# EasyEDA schematic SCH_Fisurometro_v2_2025-02-20.json
TITLE: Fisurómetro; REV: 1.0; Date: 2025-02-19; Sheet: 1/1; Drawn By: miguelenterria; Company: MediaLab
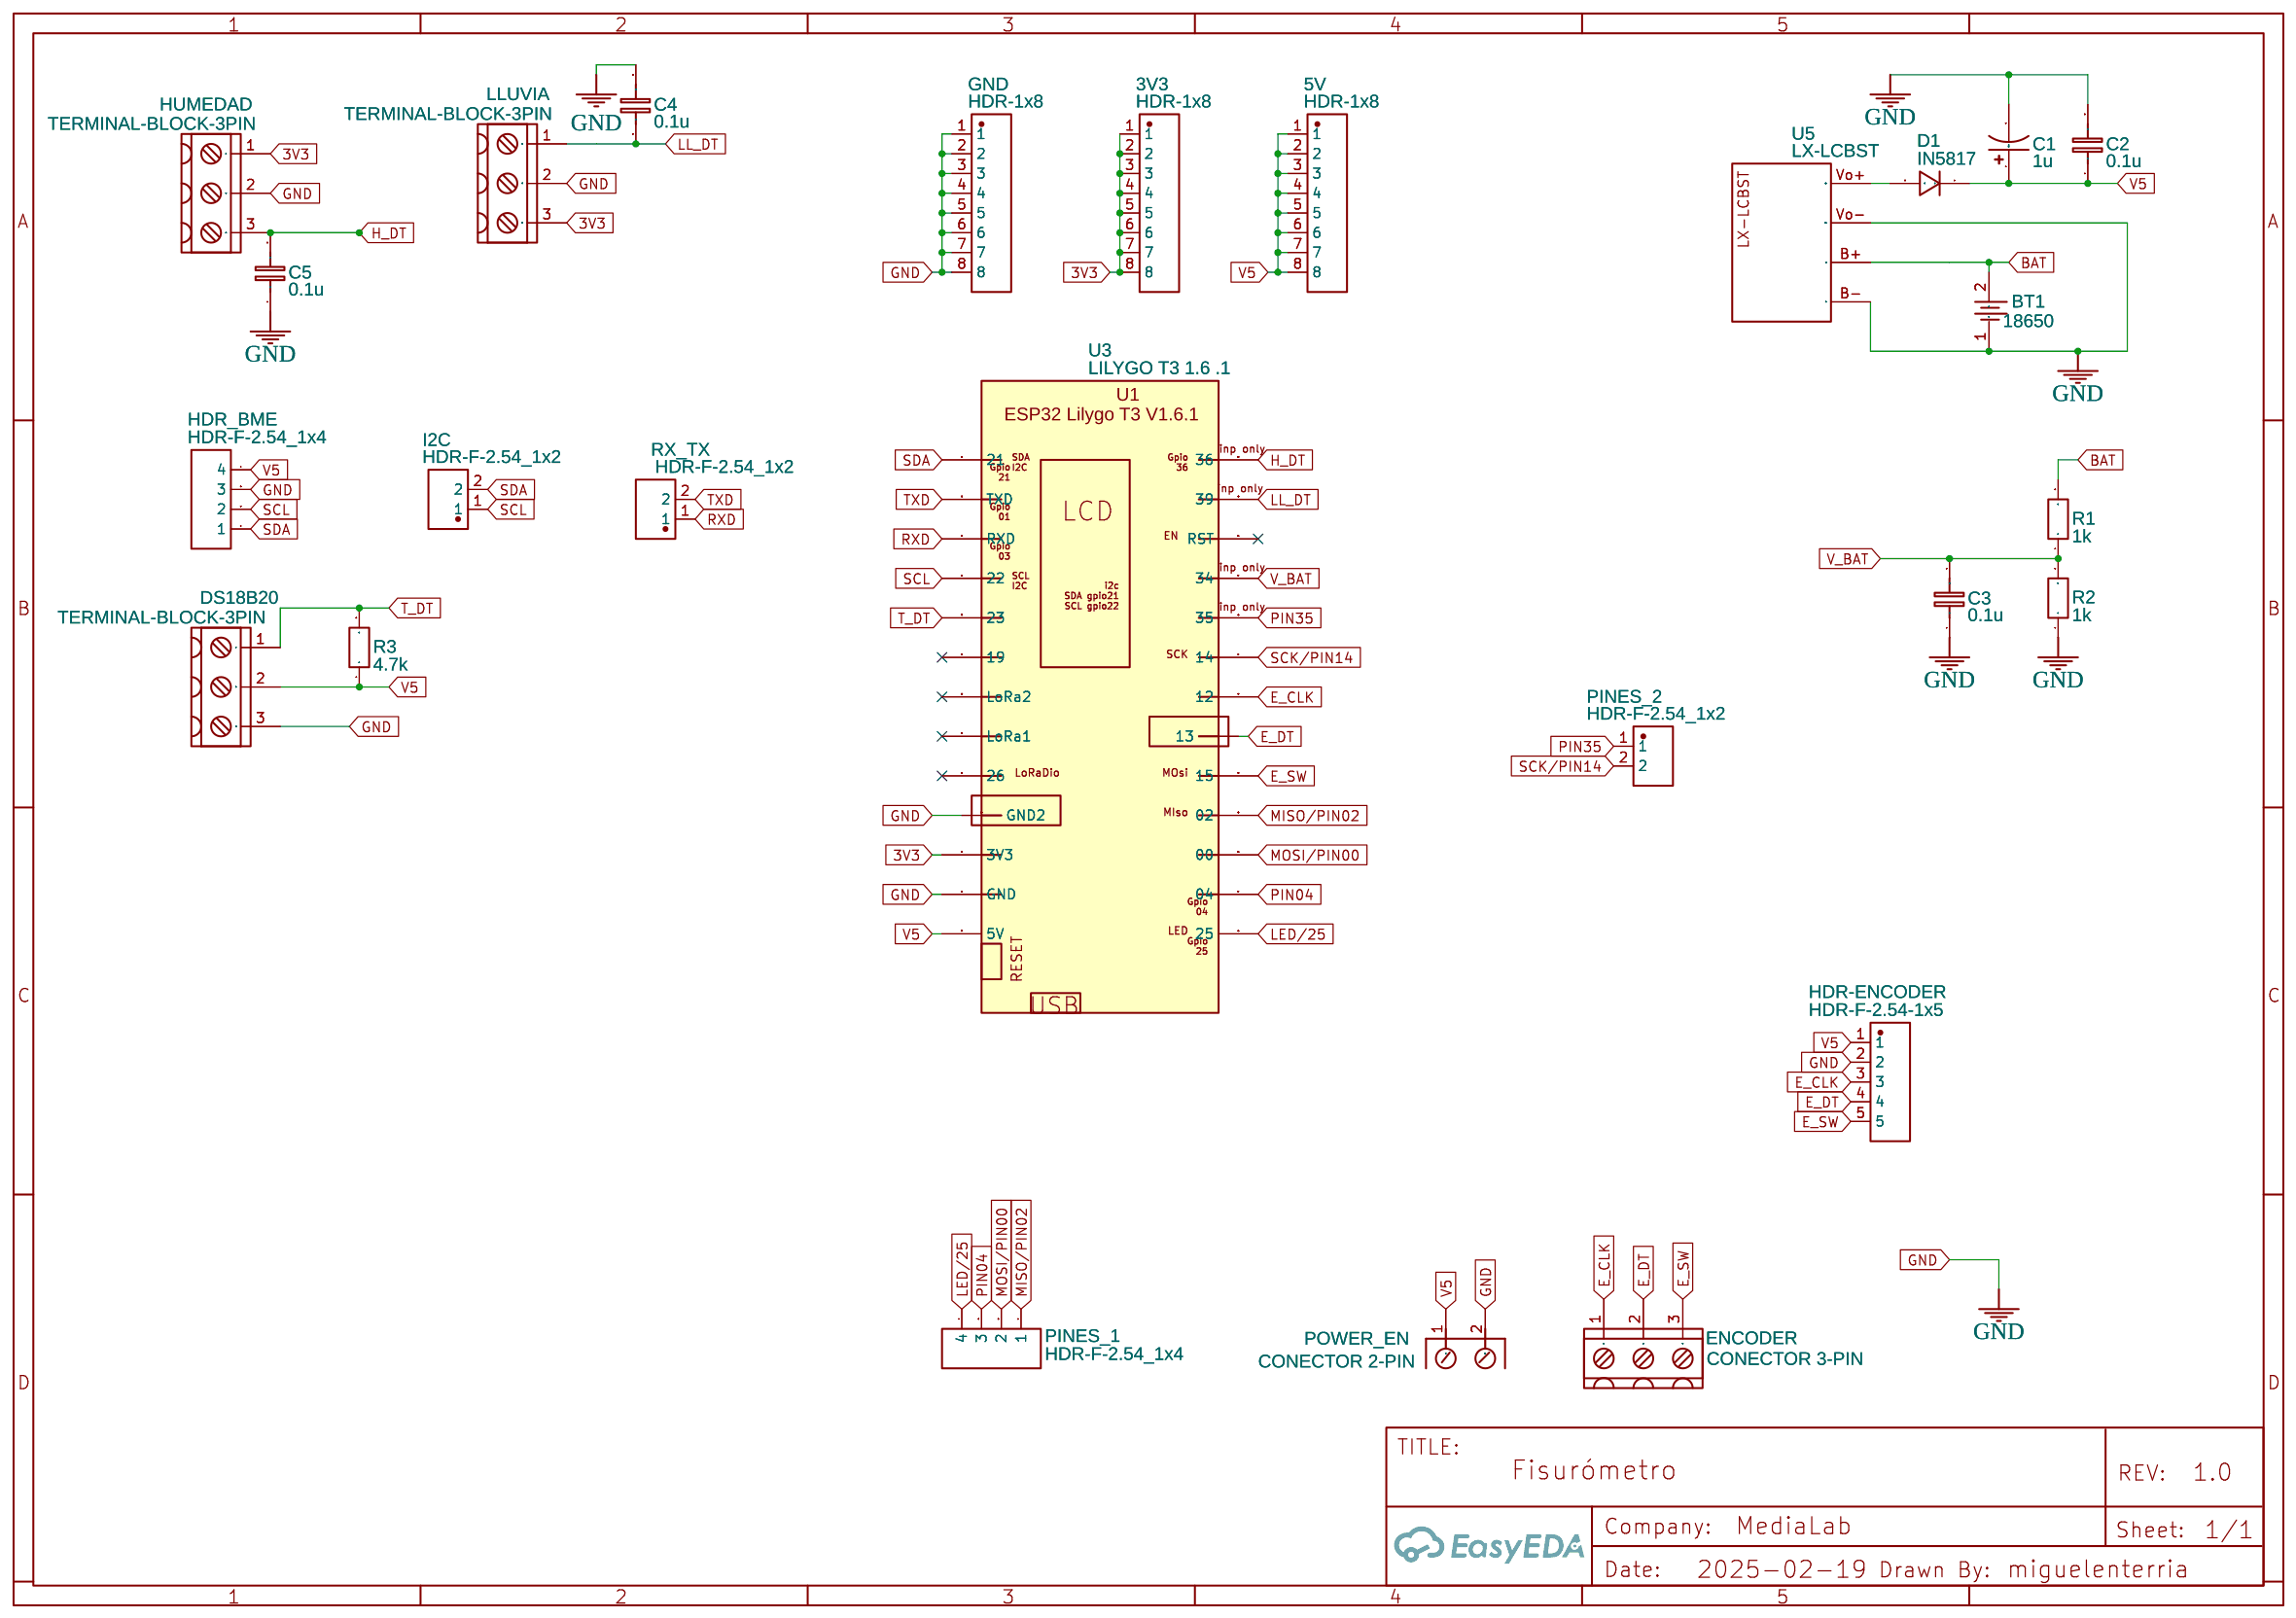
[diagram p0: schematic sheet]

## Parts
3V3  HDR-1x8  [HDR-1X8]
5V  HDR-1x8  [HDR-1X8]
BT1  18650  [BAT-TH_BH-18650-A1AJ006]
C1  1u  [CAP-D6.3×F2.5]
C2  0.1u  [RAD-0.3]
C3  0.1u  [RAD-0.3]
C4  0.1u  [RAD-0.3]
C5  0.1u  [RAD-0.3]
D1  IN5817  [DO-41_BD2.4-L4.7-P8.70-D0.9-RD]
DS18B20  TERMINAL-BLOCK-3PIN  [TERMINAL-BLOCKS-3PIN]
ENCODER  CONECTOR 3-PIN  [TERMINAL-BLOCKS-3PIN]
GND  HDR-1x8  [HDR-1X8]
HDR-ENCODER  HDR-F-2.54-1x5  [HDR-TH_5P-P1.27_C9900008152]
HDR_BME  HDR-F-2.54_1x4  [HDR-F-2.54_1X4]
HUMEDAD  TERMINAL-BLOCK-3PIN  [TERMINAL-BLOCKS-3PIN]
I2C  HDR-F-2.54_1x2  [CONN-TH_HC-PZ254-11.5L-1X2PZ]
LLUVIA  TERMINAL-BLOCK-3PIN  [TERMINAL-BLOCKS-3PIN]
PINES_1  HDR-F-2.54_1x4  [HDR-F-2.54_1X4]
PINES_2  HDR-F-2.54_1x2  [CONN-TH_HC-PZ254-11.5L-1X2PZ]
POWER_EN  CONECTOR 2-PIN  [5A_2PIN-TERMINALBLOCK]
R1  1k  [R_AXIAL-0.6]
R2  1k  [R_AXIAL-0.6]
R3  4.7k  [R_AXIAL-0.6]
RX_TX  HDR-F-2.54_1x2  [CONN-TH_HC-PZ254-11.5L-1X2PZ]
U3  LILYGO T3 1.6 .1  [LILYGO T3 1.6.1]
U5  LX-LCBST  [LX-LCBST]

## Library data of the parts
3V3 5V GND = HDR-1x8: Contributor: miguelenterria
BT1 = BH-18650-A1AJ006: Supplier: LCSC; Supplier Part: C5290175; Manufacturer: MYOUNG(美阳); Contributor: lcsc; JLCPCB Part Class: Extended Part
C1 = CE_TH_D6.3×F2.5_US: Contributor: LCEDA_Lib
C2-C5 = C_RAD-0.3_EU: Contributor: LCEDA_Lib
D1 = 1N4007: Supplier: LCSC; Manufacturer: SEMTECH; Supplier Part: C106903; Contributor: LCEDA_Lib
DS18B20 ENCODER HUMEDAD LLUVIA = TERMINAL-BLOCK-3PIN: Manufacturer Part: Delhi; Contributor: vazhayila; Supplier Part: INDIAMART; Manufacturer: Keltron
HDR-ENCODER = HDR-1X5_C9900008152: Contributor: LCSC; Supplier: LCSC; Supplier Part: C9900008152; Manufacturer: null; Manufacturer Part: HDR-1X5
HDR_BME PINES_1 = HDR-F-2.54_1x4: Supplier Part: C225501; Supplier: LCSC; Contributor: halim.dudak
I2C PINES_2 RX_TX = HC-PZ254-11.5L-1X2PZ: Supplier: LCSC; Supplier Part: C27985187; Manufacturer: HC(虹成电子); Manufacturer Part: HC-PZ254-11.5L-1x2PZ; Contributor: lcsc; JLCPCB Part Class: Extended Part
POWER_EN = 2pin-5A_TerminalBlock: Contributor: Christel_Peeris
R1-R3 = R_AXIAL-0.6_EU: Contributor: LCEDA_Lib
U3 = LILYGO T3 1.6 .1: Manufacturer Part: LILYGO T3 1.6; Supplier Part: LILYGO T3 1.6; Contributor: HTDvN
U5 = LX-LCBST: Contributor: tonydc

## Nets
3V3: 3V3.1 3V3.2 3V3.3 3V3.4 3V3.5 3V3.6 3V3.7 3V3.8 HUMEDAD.1 LLUVIA.3 U3.3V3
GND: BT1.1 C1.2 C2.2 C3.1 C4.2 C5.1 DS18B20.3 GND.1 GND.2 GND.3 GND.4 GND.5 GND.6 GND.7 GND.8 HDR-ENCODER.2 HDR_BME.3 HUMEDAD.2 LLUVIA.2 POWER_EN.2 R2.1 U3.GND U3.GND2 U5.B- U5.Vo-(Vout-)
V5: 5V.1 5V.2 5V.3 5V.4 5V.5 5V.6 5V.7 5V.8 C1.1 C2.1 D1.1 DS18B20.2 HDR-ENCODER.1 HDR_BME.4 POWER_EN.1 R3.1 U3.5V
BAT: BT1.2 R1.2 U5.B+
E_CLK: ENCODER.1 HDR-ENCODER.3 U3.12
E_DT: ENCODER.2 HDR-ENCODER.4 U3.13
E_SW: ENCODER.3 HDR-ENCODER.5 U3.15
H_DT: C5.2 HUMEDAD.3 U3.36
LED/25: PINES_1.4 U3.25
LL_DT: C4.1 LLUVIA.1 U3.39
MISO/PIN02: PINES_1.1 U3.02
MOSI/PIN00: PINES_1.2 U3.00
PIN04: PINES_1.3 U3.04
PIN35: PINES_2.1 U3.35
RXD: RX_TX.1 U3.RXD
SCK/PIN14: PINES_2.2 U3.14
SCL: HDR_BME.2 I2C.1 U3.22
SDA: HDR_BME.1 I2C.2 U3.21
T_DT: DS18B20.1 R3.2 U3.23
TXD: RX_TX.2 U3.TXD
V_BAT: C3.2 R1.1 R2.2 U3.34
Net-(D1-2): D1.2 U5.Vo+(Vout+)

Not connected (* = marked no-connect by the designer): U3 19* 26* LORA1(LoRa1)* LORA2(LoRa2)* RST*
